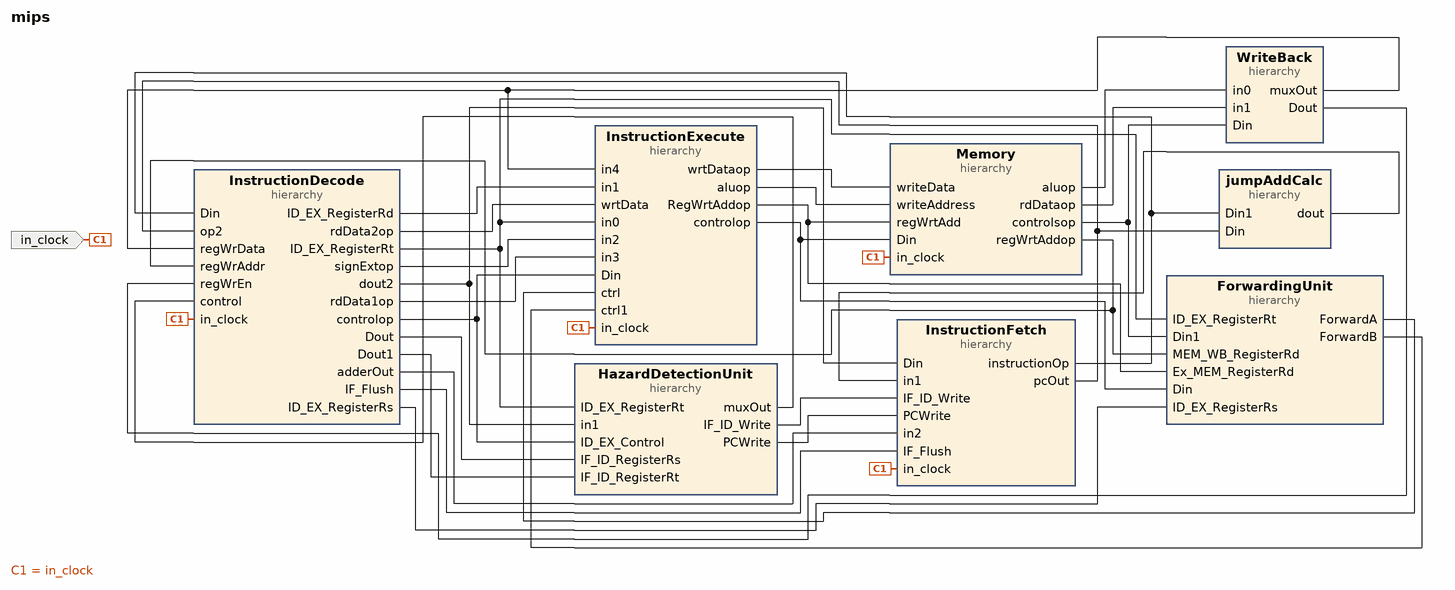
[diagram p0: block diagram of the top level]
# Vivado block design mips, xc7z020clg400-1, Vivado 2020.2
create_bd_design mips

create_bd_port -dir I -type clk in_clock

create_bd_cell -type hier Memory
create_bd_cell -type hier WriteBack
create_bd_cell -type hier InstructionFetch
create_bd_cell -type hier InstructionExecute
create_bd_cell -type hier ForwardingUnit
create_bd_cell -type hier HazardDetectionUnit
create_bd_cell -type hier jumpAddCalc
create_bd_cell -type hier InstructionDecode

# ---- hierarchy /Memory ----
current_bd_instance /Memory
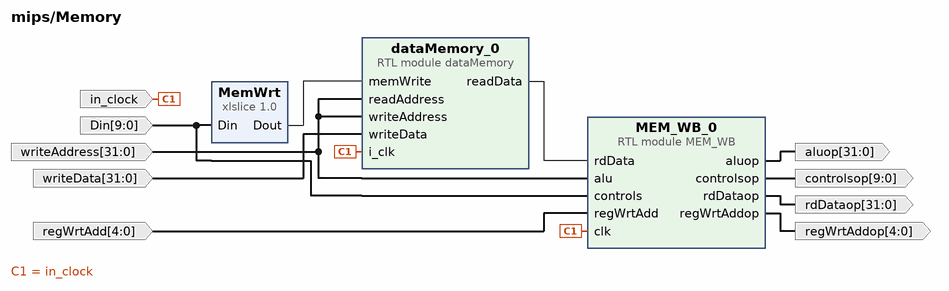
[diagram p1: block diagram inside /Memory]
create_bd_pin -dir I -from 9 -to 0 Din
create_bd_pin -dir I -from 31 -to 0 writeAddress
create_bd_pin -dir I -from 4 -to 0 regWrtAdd
create_bd_pin -dir I -type clk in_clock
create_bd_pin -dir O -from 31 -to 0 rdDataop
create_bd_pin -dir O -from 9 -to 0 controlsop
create_bd_pin -dir O -from 31 -to 0 aluop
create_bd_pin -dir O -from 4 -to 0 regWrtAddop
create_bd_pin -dir I -from 31 -to 0 writeData

create_bd_cell -type module -reference MEM_WB MEM_WB_0
create_bd_cell -type ip -vlnv xilinx.com:ip:xlslice:1.0 MemWrt
set_property -dict {CONFIG.DIN_FROM 6 CONFIG.DIN_TO 6 CONFIG.DIN_WIDTH 10 CONFIG.DOUT_WIDTH 1} [get_bd_cells MemWrt]
create_bd_cell -type module -reference dataMemory dataMemory_0

# ---- hierarchy /WriteBack ----
current_bd_instance /WriteBack
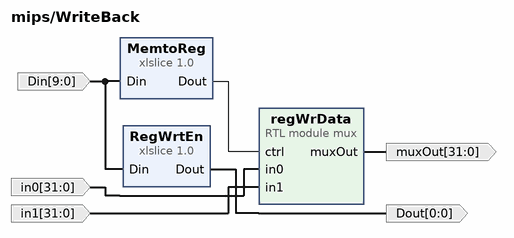
[diagram p2: block diagram inside /WriteBack]
create_bd_pin -dir I -from 31 -to 0 in0
create_bd_pin -dir I -from 31 -to 0 in1
create_bd_pin -dir O -from 31 -to 0 muxOut
create_bd_pin -dir I -from 9 -to 0 Din
create_bd_pin -dir O -from 0 -to 0 Dout

create_bd_cell -type ip -vlnv xilinx.com:ip:xlslice:1.0 MemtoReg
set_property -dict {CONFIG.DIN_FROM 7 CONFIG.DIN_TO 7 CONFIG.DIN_WIDTH 10 CONFIG.DOUT_WIDTH 1} [get_bd_cells MemtoReg]
create_bd_cell -type ip -vlnv xilinx.com:ip:xlslice:1.0 RegWrtEn
set_property -dict {CONFIG.DIN_FROM 1 CONFIG.DIN_TO 1 CONFIG.DIN_WIDTH 10 CONFIG.DOUT_WIDTH 1} [get_bd_cells RegWrtEn]
create_bd_cell -type module -reference mux regWrData
set_property -dict {CONFIG.width 32} [get_bd_cells regWrData]

# ---- hierarchy /InstructionFetch ----
current_bd_instance /InstructionFetch
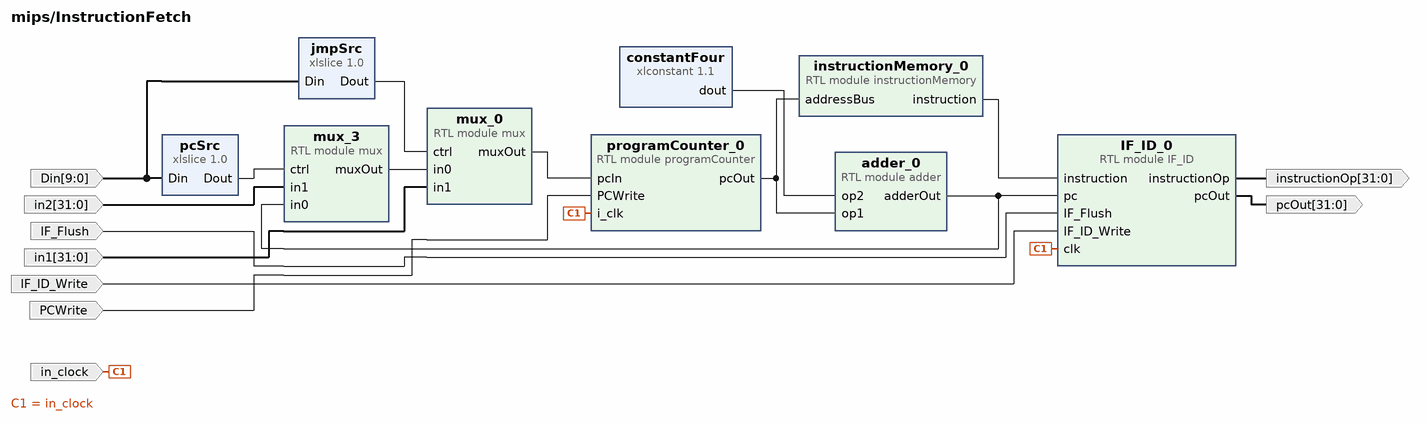
[diagram p3: block diagram inside /InstructionFetch]
create_bd_pin -dir I -from 9 -to 0 Din
create_bd_pin -dir I -type clk in_clock
create_bd_pin -dir I IF_Flush
create_bd_pin -dir O -from 31 -to 0 instructionOp
create_bd_pin -dir O -from 31 -to 0 pcOut
create_bd_pin -dir I -from 31 -to 0 in1
create_bd_pin -dir I -from 31 -to 0 in2
create_bd_pin -dir I IF_ID_Write
create_bd_pin -dir I PCWrite

create_bd_cell -type ip -vlnv xilinx.com:ip:xlslice:1.0 jmpSrc
set_property -dict {CONFIG.DIN_FROM 8 CONFIG.DIN_TO 8 CONFIG.DIN_WIDTH 10 CONFIG.DOUT_WIDTH 1} [get_bd_cells jmpSrc]
create_bd_cell -type module -reference mux mux_0
set_property -dict {CONFIG.width 32} [get_bd_cells mux_0]
create_bd_cell -type ip -vlnv xilinx.com:ip:xlslice:1.0 pcSrc
set_property -dict {CONFIG.DIN_FROM 9 CONFIG.DIN_TO 9 CONFIG.DIN_WIDTH 10 CONFIG.DOUT_WIDTH 1} [get_bd_cells pcSrc]
create_bd_cell -type ip -vlnv xilinx.com:ip:xlconstant:1.1 constantFour
set_property -dict {CONFIG.CONST_VAL 4 CONFIG.CONST_WIDTH 32} [get_bd_cells constantFour]
create_bd_cell -type module -reference adder adder_0
set_property -dict {CONFIG.width 32} [get_bd_cells adder_0]
create_bd_cell -type module -reference mux mux_3
set_property -dict {CONFIG.width 32} [get_bd_cells mux_3]
create_bd_cell -type module -reference programCounter programCounter_0
create_bd_cell -type module -reference IF_ID IF_ID_0
create_bd_cell -type module -reference instructionMemory instructionMemory_0

# ---- hierarchy /InstructionExecute ----
current_bd_instance /InstructionExecute
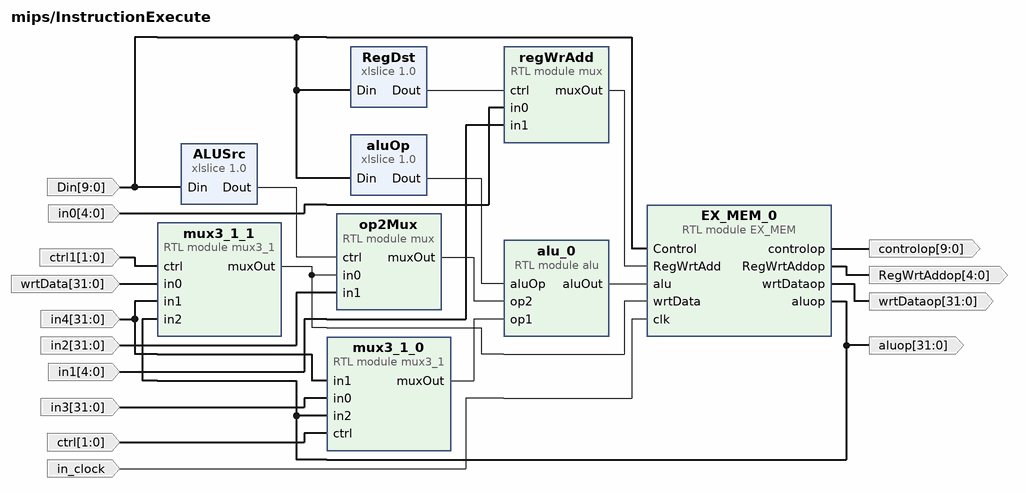
[diagram p4: block diagram inside /InstructionExecute]
create_bd_pin -dir I -from 4 -to 0 in0
create_bd_pin -dir I -from 4 -to 0 in1
create_bd_pin -dir I -from 9 -to 0 Din
create_bd_pin -dir I -from 31 -to 0 wrtData
create_bd_pin -dir I -from 31 -to 0 in2
create_bd_pin -dir I -from 31 -to 0 in3
create_bd_pin -dir I -from 31 -to 0 in4
create_bd_pin -dir O -from 31 -to 0 aluop
create_bd_pin -dir I -from 1 -to 0 ctrl
create_bd_pin -dir I -type clk in_clock
create_bd_pin -dir O -from 9 -to 0 controlop
create_bd_pin -dir O -from 31 -to 0 wrtDataop
create_bd_pin -dir O -from 4 -to 0 RegWrtAddop
create_bd_pin -dir I -from 1 -to 0 ctrl1

create_bd_cell -type module -reference alu alu_0
create_bd_cell -type module -reference mux regWrAdd
set_property -dict {CONFIG.width 5} [get_bd_cells regWrAdd]
create_bd_cell -type ip -vlnv xilinx.com:ip:xlslice:1.0 RegDst
set_property -dict {CONFIG.DIN_WIDTH 10} [get_bd_cells RegDst]
create_bd_cell -type module -reference mux op2Mux
set_property -dict {CONFIG.width 32} [get_bd_cells op2Mux]
create_bd_cell -type module -reference mux3_1 mux3_1_0
set_property -dict {CONFIG.width 32} [get_bd_cells mux3_1_0]
create_bd_cell -type module -reference EX_MEM EX_MEM_0
create_bd_cell -type ip -vlnv xilinx.com:ip:xlslice:1.0 aluOp
set_property -dict {CONFIG.DIN_FROM 5 CONFIG.DIN_TO 3 CONFIG.DIN_WIDTH 10 CONFIG.DOUT_WIDTH 3} [get_bd_cells aluOp]
create_bd_cell -type ip -vlnv xilinx.com:ip:xlslice:1.0 ALUSrc
set_property -dict {CONFIG.DIN_FROM 2 CONFIG.DIN_TO 2 CONFIG.DIN_WIDTH 10 CONFIG.DOUT_WIDTH 1} [get_bd_cells ALUSrc]
create_bd_cell -type module -reference mux3_1 mux3_1_1
set_property -dict {CONFIG.width 32} [get_bd_cells mux3_1_1]

# ---- hierarchy /ForwardingUnit ----
current_bd_instance /ForwardingUnit
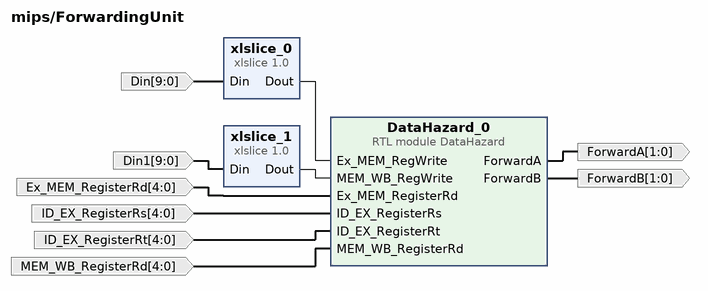
[diagram p5: block diagram inside /ForwardingUnit]
create_bd_pin -dir I -from 9 -to 0 Din
create_bd_pin -dir I -from 9 -to 0 Din1
create_bd_pin -dir I -from 4 -to 0 Ex_MEM_RegisterRd
create_bd_pin -dir I -from 4 -to 0 ID_EX_RegisterRs
create_bd_pin -dir I -from 4 -to 0 ID_EX_RegisterRt
create_bd_pin -dir I -from 4 -to 0 MEM_WB_RegisterRd
create_bd_pin -dir O -from 1 -to 0 ForwardA
create_bd_pin -dir O -from 1 -to 0 ForwardB

create_bd_cell -type ip -vlnv xilinx.com:ip:xlslice:1.0 xlslice_0
set_property -dict {CONFIG.DIN_FROM 1 CONFIG.DIN_TO 1 CONFIG.DIN_WIDTH 10 CONFIG.DOUT_WIDTH 1} [get_bd_cells xlslice_0]
create_bd_cell -type ip -vlnv xilinx.com:ip:xlslice:1.0 xlslice_1
set_property -dict {CONFIG.DIN_FROM 1 CONFIG.DIN_TO 1 CONFIG.DIN_WIDTH 10 CONFIG.DOUT_WIDTH 1} [get_bd_cells xlslice_1]
create_bd_cell -type module -reference DataHazard DataHazard_0

# ---- hierarchy /HazardDetectionUnit ----
current_bd_instance /HazardDetectionUnit
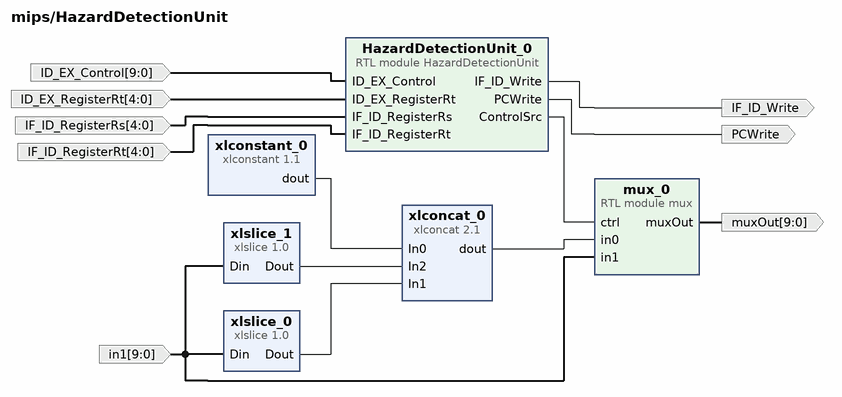
[diagram p6: block diagram inside /HazardDetectionUnit]
create_bd_pin -dir I -from 9 -to 0 ID_EX_Control
create_bd_pin -dir I -from 4 -to 0 ID_EX_RegisterRt
create_bd_pin -dir I -from 4 -to 0 IF_ID_RegisterRs
create_bd_pin -dir I -from 4 -to 0 IF_ID_RegisterRt
create_bd_pin -dir O PCWrite
create_bd_pin -dir O IF_ID_Write
create_bd_pin -dir I -from 9 -to 0 in1
create_bd_pin -dir O -from 9 -to 0 muxOut

create_bd_cell -type ip -vlnv xilinx.com:ip:xlconstant:1.1 xlconstant_0
set_property -dict {CONFIG.CONST_VAL 0 CONFIG.CONST_WIDTH 8} [get_bd_cells xlconstant_0]
create_bd_cell -type module -reference mux mux_0
set_property -dict {CONFIG.width 10} [get_bd_cells mux_0]
create_bd_cell -type module -reference HazardDetectionUnit HazardDetectionUnit_0
create_bd_cell -type ip -vlnv xilinx.com:ip:xlslice:1.0 xlslice_0
set_property -dict {CONFIG.DIN_FROM 8 CONFIG.DIN_TO 8 CONFIG.DIN_WIDTH 10 CONFIG.DOUT_WIDTH 1} [get_bd_cells xlslice_0]
create_bd_cell -type ip -vlnv xilinx.com:ip:xlslice:1.0 xlslice_1
set_property -dict {CONFIG.DIN_FROM 9 CONFIG.DIN_TO 9 CONFIG.DIN_WIDTH 10 CONFIG.DOUT_WIDTH 1} [get_bd_cells xlslice_1]
create_bd_cell -type ip -vlnv xilinx.com:ip:xlconcat:2.1 xlconcat_0
set_property -dict {CONFIG.IN0_WIDTH 8 CONFIG.NUM_PORTS 3} [get_bd_cells xlconcat_0]

# ---- hierarchy /jumpAddCalc ----
current_bd_instance /jumpAddCalc
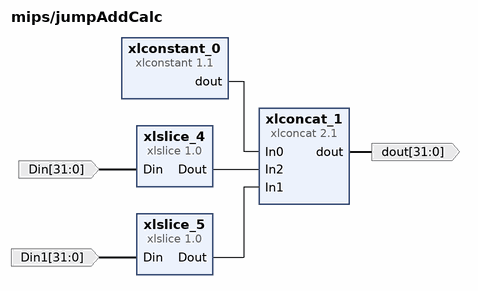
[diagram p7: block diagram inside /jumpAddCalc]
create_bd_pin -dir I -from 31 -to 0 Din
create_bd_pin -dir I -from 31 -to 0 Din1
create_bd_pin -dir O -from 31 -to 0 dout

create_bd_cell -type ip -vlnv xilinx.com:ip:xlconcat:2.1 xlconcat_1
set_property -dict {CONFIG.IN0_WIDTH 2 CONFIG.IN1_WIDTH 26 CONFIG.IN2_WIDTH 4 CONFIG.NUM_PORTS 3} [get_bd_cells xlconcat_1]
create_bd_cell -type ip -vlnv xilinx.com:ip:xlslice:1.0 xlslice_4
set_property -dict {CONFIG.DIN_FROM 31 CONFIG.DIN_TO 28 CONFIG.DOUT_WIDTH 4} [get_bd_cells xlslice_4]
create_bd_cell -type ip -vlnv xilinx.com:ip:xlslice:1.0 xlslice_5
set_property -dict {CONFIG.DIN_FROM 25 CONFIG.DOUT_WIDTH 26} [get_bd_cells xlslice_5]
create_bd_cell -type ip -vlnv xilinx.com:ip:xlconstant:1.1 xlconstant_0
set_property -dict {CONFIG.CONST_VAL 0 CONFIG.CONST_WIDTH 2} [get_bd_cells xlconstant_0]

# ---- hierarchy /InstructionDecode ----
current_bd_instance /InstructionDecode
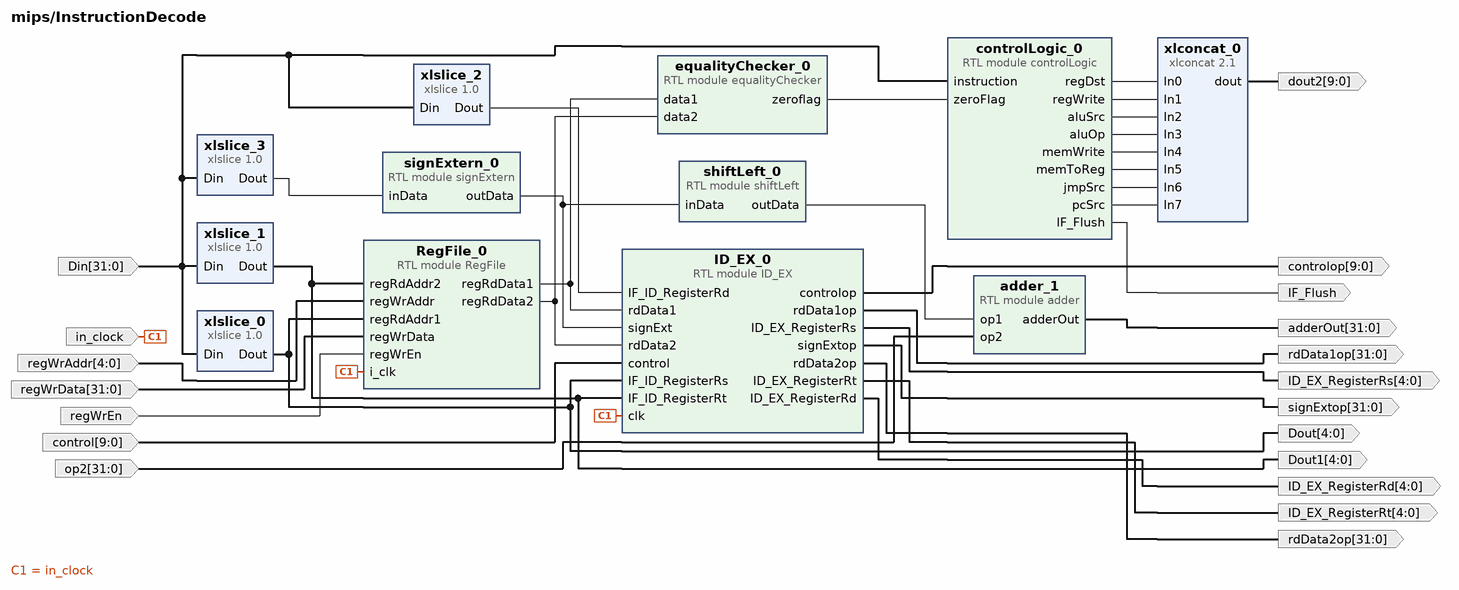
[diagram p8: block diagram inside /InstructionDecode]
create_bd_pin -dir I -type clk in_clock
create_bd_pin -dir I -from 9 -to 0 control
create_bd_pin -dir O -from 4 -to 0 Dout
create_bd_pin -dir O -from 4 -to 0 Dout1
create_bd_pin -dir O -from 9 -to 0 controlop
create_bd_pin -dir O -from 31 -to 0 signExtop
create_bd_pin -dir O -from 31 -to 0 rdData1op
create_bd_pin -dir O -from 31 -to 0 rdData2op
create_bd_pin -dir O -from 4 -to 0 ID_EX_RegisterRs
create_bd_pin -dir O -from 4 -to 0 ID_EX_RegisterRt
create_bd_pin -dir O -from 4 -to 0 ID_EX_RegisterRd
create_bd_pin -dir I -from 31 -to 0 Din
create_bd_pin -dir O IF_Flush
create_bd_pin -dir I -from 4 -to 0 regWrAddr
create_bd_pin -dir I -from 31 -to 0 regWrData
create_bd_pin -dir I regWrEn
create_bd_pin -dir I -from 31 -to 0 op2
create_bd_pin -dir O -from 31 -to 0 adderOut
create_bd_pin -dir O -from 9 -to 0 dout2

create_bd_cell -type module -reference ID_EX ID_EX_0
create_bd_cell -type module -reference controlLogic controlLogic_0
create_bd_cell -type ip -vlnv xilinx.com:ip:xlslice:1.0 xlslice_0
set_property -dict {CONFIG.DIN_FROM 25 CONFIG.DIN_TO 21 CONFIG.DOUT_WIDTH 5} [get_bd_cells xlslice_0]
create_bd_cell -type ip -vlnv xilinx.com:ip:xlslice:1.0 xlslice_1
set_property -dict {CONFIG.DIN_FROM 20 CONFIG.DIN_TO 16 CONFIG.DOUT_WIDTH 5} [get_bd_cells xlslice_1]
create_bd_cell -type module -reference shiftLeft shiftLeft_0
create_bd_cell -type ip -vlnv xilinx.com:ip:xlslice:1.0 xlslice_2
set_property -dict {CONFIG.DIN_FROM 15 CONFIG.DIN_TO 11 CONFIG.DOUT_WIDTH 5} [get_bd_cells xlslice_2]
create_bd_cell -type ip -vlnv xilinx.com:ip:xlslice:1.0 xlslice_3
set_property -dict {CONFIG.DIN_FROM 15 CONFIG.DOUT_WIDTH 16} [get_bd_cells xlslice_3]
create_bd_cell -type module -reference equalityChecker equalityChecker_0
create_bd_cell -type module -reference RegFile RegFile_0
create_bd_cell -type module -reference signExtern signExtern_0
create_bd_cell -type module -reference adder adder_1
set_property -dict {CONFIG.width 32} [get_bd_cells adder_1]
create_bd_cell -type ip -vlnv xilinx.com:ip:xlconcat:2.1 xlconcat_0
set_property -dict {CONFIG.IN3_WIDTH 3 CONFIG.NUM_PORTS 8} [get_bd_cells xlconcat_0]

# ---- connections ----

current_bd_instance /Memory
connect_bd_net [get_bd_pins dataMemory_0/readData] [get_bd_pins MEM_WB_0/rdData]
connect_bd_net -net xlslice_0_Dout [get_bd_pins MemWrt/Dout] [get_bd_pins dataMemory_0/memWrite]
connect_bd_net -net EX_MEM_0_controlop [get_bd_pins Din] [get_bd_pins MemWrt/Din] [get_bd_pins MEM_WB_0/controls]
connect_bd_net -net InstructionExecute_aluop [get_bd_pins writeAddress] \
  [get_bd_pins MEM_WB_0/alu] [get_bd_pins dataMemory_0/readAddress] [get_bd_pins dataMemory_0/writeAddress]
connect_bd_net -net InstructionExecute_RegWrtAddop [get_bd_pins regWrtAdd] [get_bd_pins MEM_WB_0/regWrtAdd]
connect_bd_net -net i_clk_0_1 [get_bd_pins in_clock] [get_bd_pins MEM_WB_0/clk] [get_bd_pins dataMemory_0/i_clk]
connect_bd_net [get_bd_pins MEM_WB_0/rdDataop] [get_bd_pins rdDataop]
connect_bd_net [get_bd_pins MEM_WB_0/controlsop] [get_bd_pins controlsop]
connect_bd_net [get_bd_pins MEM_WB_0/aluop] [get_bd_pins aluop]
connect_bd_net -net regWrAddr_1 [get_bd_pins MEM_WB_0/regWrtAddop] [get_bd_pins regWrtAddop]
connect_bd_net -net EX_MEM_0_wrtDataop [get_bd_pins writeData] [get_bd_pins dataMemory_0/writeData]

current_bd_instance /WriteBack
connect_bd_net -net xlslice_0_Dout1 [get_bd_pins MemtoReg/Dout] [get_bd_pins regWrData/ctrl]
connect_bd_net -net MEM_WB_0_aluop [get_bd_pins in0] [get_bd_pins regWrData/in0]
connect_bd_net -net MEM_WB_0_rdDataop [get_bd_pins in1] [get_bd_pins regWrData/in1]
connect_bd_net -net mux_2_muxOut [get_bd_pins regWrData/muxOut] [get_bd_pins muxOut]
connect_bd_net -net MEM_WB_0_controlsop [get_bd_pins Din] [get_bd_pins RegWrtEn/Din] [get_bd_pins MemtoReg/Din]
connect_bd_net -net xlslice_0_Dout [get_bd_pins RegWrtEn/Dout] [get_bd_pins Dout]

current_bd_instance /InstructionFetch
connect_bd_net -net xlslice_0_Dout1 [get_bd_pins jmpSrc/Dout] [get_bd_pins mux_0/ctrl]
connect_bd_net [get_bd_pins instructionMemory_0/instruction] [get_bd_pins IF_ID_0/instruction]
connect_bd_net [get_bd_pins adder_0/adderOut] [get_bd_pins mux_3/in0] [get_bd_pins IF_ID_0/pc]
connect_bd_net [get_bd_pins mux_3/muxOut] [get_bd_pins mux_0/in0]
connect_bd_net [get_bd_pins mux_0/muxOut] [get_bd_pins programCounter_0/pcIn]
connect_bd_net [get_bd_pins programCounter_0/pcOut] [get_bd_pins adder_0/op1] [get_bd_pins instructionMemory_0/addressBus]
connect_bd_net [get_bd_pins pcSrc/Dout] [get_bd_pins mux_3/ctrl]
connect_bd_net [get_bd_pins constantFour/dout] [get_bd_pins adder_0/op2]
connect_bd_net -net Conrols [get_bd_pins Din] [get_bd_pins pcSrc/Din] [get_bd_pins jmpSrc/Din]
connect_bd_net -net i_clk_0_1 [get_bd_pins in_clock] [get_bd_pins programCounter_0/i_clk] [get_bd_pins IF_ID_0/clk]
connect_bd_net -net InsructionDecode_IF_Flush [get_bd_pins IF_Flush] [get_bd_pins IF_ID_0/IF_Flush]
connect_bd_net [get_bd_pins IF_ID_0/instructionOp] [get_bd_pins instructionOp]
connect_bd_net -net InstructionFetch_pcOut [get_bd_pins IF_ID_0/pcOut] [get_bd_pins pcOut]
connect_bd_net -net InsructionDecode_dout1 [get_bd_pins in1] [get_bd_pins mux_0/in1]
connect_bd_net -net InstructionDecode_adderOut [get_bd_pins in2] [get_bd_pins mux_3/in1]
connect_bd_net [get_bd_pins IF_ID_Write] [get_bd_pins IF_ID_0/IF_ID_Write]
connect_bd_net [get_bd_pins PCWrite] [get_bd_pins programCounter_0/PCWrite]

current_bd_instance /InstructionExecute
connect_bd_net [get_bd_pins mux3_1_0/muxOut] [get_bd_pins alu_0/op1]
connect_bd_net -net xlslice_0_Dout1 [get_bd_pins aluOp/Dout] [get_bd_pins alu_0/aluOp]
connect_bd_net [get_bd_pins alu_0/aluOut] [get_bd_pins EX_MEM_0/alu]
connect_bd_net -net xlslice_0_Dout_1 [get_bd_pins RegDst/Dout] [get_bd_pins regWrAdd/ctrl]
connect_bd_net [get_bd_pins regWrAdd/muxOut] [get_bd_pins EX_MEM_0/RegWrtAdd]
connect_bd_net -net xlslice_4_Dout [get_bd_pins ALUSrc/Dout] [get_bd_pins op2Mux/ctrl]
connect_bd_net -net ID_EX_0_slicetsop [get_bd_pins in0] [get_bd_pins regWrAdd/in0]
connect_bd_net -net ID_EX_0_slicefeop [get_bd_pins in1] [get_bd_pins regWrAdd/in1]
connect_bd_net -net ID_EX_0_controlop [get_bd_pins Din] \
  [get_bd_pins ALUSrc/Din] [get_bd_pins aluOp/Din] [get_bd_pins EX_MEM_0/Control] [get_bd_pins RegDst/Din]
connect_bd_net -net InstructionDecode_signExtop [get_bd_pins in2] [get_bd_pins op2Mux/in1]
connect_bd_net -net InsructionDecode_rdData1op [get_bd_pins in3] [get_bd_pins mux3_1_0/in0]
connect_bd_net -net mux_2_muxOut [get_bd_pins in4] [get_bd_pins mux3_1_1/in1] [get_bd_pins mux3_1_0/in1]
connect_bd_net -net InstructionExecute_aluop [get_bd_pins EX_MEM_0/aluop] [get_bd_pins aluop] [get_bd_pins mux3_1_1/in2] [get_bd_pins mux3_1_0/in2]
connect_bd_net -net ForwardingUnit_ForwardA [get_bd_pins ctrl] [get_bd_pins mux3_1_0/ctrl]
connect_bd_net -net i_clk_0_1 [get_bd_pins in_clock] [get_bd_pins EX_MEM_0/clk]
connect_bd_net -net InstructionExecute_controlop [get_bd_pins EX_MEM_0/controlop] [get_bd_pins controlop]
connect_bd_net [get_bd_pins EX_MEM_0/wrtDataop] [get_bd_pins wrtDataop]
connect_bd_net -net InstructionExecute_RegWrtAddop [get_bd_pins EX_MEM_0/RegWrtAddop] [get_bd_pins RegWrtAddop]
connect_bd_net -net ForwardingUnit_ForwardB [get_bd_pins ctrl1] [get_bd_pins mux3_1_1/ctrl]
connect_bd_net [get_bd_pins wrtData] [get_bd_pins mux3_1_1/in0]
connect_bd_net [get_bd_pins mux3_1_1/muxOut] [get_bd_pins op2Mux/in0] [get_bd_pins EX_MEM_0/wrtData]
connect_bd_net [get_bd_pins op2Mux/muxOut] [get_bd_pins alu_0/op2]

current_bd_instance /ForwardingUnit
connect_bd_net [get_bd_pins xlslice_0/Dout] [get_bd_pins DataHazard_0/Ex_MEM_RegWrite]
connect_bd_net [get_bd_pins xlslice_1/Dout] [get_bd_pins DataHazard_0/MEM_WB_RegWrite]
connect_bd_net -net InstructionExecute_controlop [get_bd_pins Din] [get_bd_pins xlslice_0/Din]
connect_bd_net -net MEM_WB_0_controlsop [get_bd_pins Din1] [get_bd_pins xlslice_1/Din]
connect_bd_net -net InstructionExecute_RegWrtAddop [get_bd_pins Ex_MEM_RegisterRd] [get_bd_pins DataHazard_0/Ex_MEM_RegisterRd]
connect_bd_net -net InsructionDecode_ID_EX_RegisterRs [get_bd_pins ID_EX_RegisterRs] [get_bd_pins DataHazard_0/ID_EX_RegisterRs]
connect_bd_net -net ID_EX_0_slicetsop [get_bd_pins ID_EX_RegisterRt] [get_bd_pins DataHazard_0/ID_EX_RegisterRt]
connect_bd_net -net regWrAddr_1 [get_bd_pins MEM_WB_RegisterRd] [get_bd_pins DataHazard_0/MEM_WB_RegisterRd]
connect_bd_net -net ForwardingUnit_ForwardA [get_bd_pins DataHazard_0/ForwardA] [get_bd_pins ForwardA]
connect_bd_net -net ForwardingUnit_ForwardB [get_bd_pins DataHazard_0/ForwardB] [get_bd_pins ForwardB]

current_bd_instance /HazardDetectionUnit
connect_bd_net [get_bd_pins HazardDetectionUnit_0/ControlSrc] [get_bd_pins mux_0/ctrl]
connect_bd_net -net ID_EX_0_controlop [get_bd_pins ID_EX_Control] [get_bd_pins HazardDetectionUnit_0/ID_EX_Control]
connect_bd_net -net ID_EX_0_slicetsop [get_bd_pins ID_EX_RegisterRt] [get_bd_pins HazardDetectionUnit_0/ID_EX_RegisterRt]
connect_bd_net -net xlslice_0_Dout_1 [get_bd_pins IF_ID_RegisterRs] [get_bd_pins HazardDetectionUnit_0/IF_ID_RegisterRs]
connect_bd_net -net xlslice_1_Dout [get_bd_pins IF_ID_RegisterRt] [get_bd_pins HazardDetectionUnit_0/IF_ID_RegisterRt]
connect_bd_net [get_bd_pins HazardDetectionUnit_0/PCWrite] [get_bd_pins PCWrite]
connect_bd_net [get_bd_pins HazardDetectionUnit_0/IF_ID_Write] [get_bd_pins IF_ID_Write]
connect_bd_net -net xlconcat_0_dout [get_bd_pins in1] [get_bd_pins mux_0/in1] [get_bd_pins xlslice_0/Din] [get_bd_pins xlslice_1/Din]
connect_bd_net [get_bd_pins mux_0/muxOut] [get_bd_pins muxOut]
connect_bd_net [get_bd_pins xlconstant_0/dout] [get_bd_pins xlconcat_0/In0]
connect_bd_net [get_bd_pins xlslice_0/Dout] [get_bd_pins xlconcat_0/In1]
connect_bd_net [get_bd_pins xlslice_1/Dout] [get_bd_pins xlconcat_0/In2]
connect_bd_net [get_bd_pins xlconcat_0/dout] [get_bd_pins mux_0/in0]

current_bd_instance /jumpAddCalc
connect_bd_net [get_bd_pins xlslice_5/Dout] [get_bd_pins xlconcat_1/In1]
connect_bd_net -net InstructionFetch_pcOut [get_bd_pins Din] [get_bd_pins xlslice_4/Din]
connect_bd_net -net IF_ID_0_instructionOp [get_bd_pins Din1] [get_bd_pins xlslice_5/Din]
connect_bd_net [get_bd_pins xlconcat_1/dout] [get_bd_pins dout]
connect_bd_net [get_bd_pins xlconstant_0/dout] [get_bd_pins xlconcat_1/In0]
connect_bd_net [get_bd_pins xlslice_4/Dout] [get_bd_pins xlconcat_1/In2]

current_bd_instance /InstructionDecode
connect_bd_net -net InstructionDecode_outData [get_bd_pins signExtern_0/outData] [get_bd_pins shiftLeft_0/inData] [get_bd_pins ID_EX_0/signExt]
connect_bd_net [get_bd_pins RegFile_0/regRdData1] [get_bd_pins equalityChecker_0/data1] [get_bd_pins ID_EX_0/rdData1]
connect_bd_net [get_bd_pins RegFile_0/regRdData2] [get_bd_pins equalityChecker_0/data2] [get_bd_pins ID_EX_0/rdData2]
connect_bd_net [get_bd_pins xlslice_2/Dout] [get_bd_pins ID_EX_0/IF_ID_RegisterRd]
connect_bd_net -net alu_0_zeroFlag1 [get_bd_pins equalityChecker_0/zeroflag] [get_bd_pins controlLogic_0/zeroFlag]
connect_bd_net [get_bd_pins controlLogic_0/regDst] [get_bd_pins xlconcat_0/In0]
connect_bd_net [get_bd_pins controlLogic_0/regWrite] [get_bd_pins xlconcat_0/In1]
connect_bd_net [get_bd_pins controlLogic_0/aluSrc] [get_bd_pins xlconcat_0/In2]
connect_bd_net [get_bd_pins controlLogic_0/aluOp] [get_bd_pins xlconcat_0/In3]
connect_bd_net [get_bd_pins controlLogic_0/memWrite] [get_bd_pins xlconcat_0/In4]
connect_bd_net [get_bd_pins controlLogic_0/memToReg] [get_bd_pins xlconcat_0/In5]
connect_bd_net [get_bd_pins controlLogic_0/jmpSrc] [get_bd_pins xlconcat_0/In6]
connect_bd_net [get_bd_pins controlLogic_0/pcSrc] [get_bd_pins xlconcat_0/In7]
connect_bd_net [get_bd_pins shiftLeft_0/outData] [get_bd_pins adder_1/op1]
connect_bd_net [get_bd_pins xlslice_3/Dout] [get_bd_pins signExtern_0/inData]
connect_bd_net -net i_clk_0_1 [get_bd_pins in_clock] [get_bd_pins RegFile_0/i_clk] [get_bd_pins ID_EX_0/clk]
connect_bd_net -net mux_0_muxOut [get_bd_pins control] [get_bd_pins ID_EX_0/control]
connect_bd_net [get_bd_pins xlslice_0/Dout] [get_bd_pins Dout] [get_bd_pins RegFile_0/regRdAddr1] [get_bd_pins ID_EX_0/IF_ID_RegisterRs]
connect_bd_net [get_bd_pins xlslice_1/Dout] [get_bd_pins Dout1] [get_bd_pins RegFile_0/regRdAddr2] [get_bd_pins ID_EX_0/IF_ID_RegisterRt]
connect_bd_net [get_bd_pins ID_EX_0/controlop] [get_bd_pins controlop]
connect_bd_net -net InstructionDecode_signExtop [get_bd_pins ID_EX_0/signExtop] [get_bd_pins signExtop]
connect_bd_net -net InsructionDecode_rdData1op [get_bd_pins ID_EX_0/rdData1op] [get_bd_pins rdData1op]
connect_bd_net -net InstructionDecode_rdData2op [get_bd_pins ID_EX_0/rdData2op] [get_bd_pins rdData2op]
connect_bd_net -net InsructionDecode_ID_EX_RegisterRs [get_bd_pins ID_EX_0/ID_EX_RegisterRs] [get_bd_pins ID_EX_RegisterRs]
connect_bd_net -net ID_EX_0_slicetsop [get_bd_pins ID_EX_0/ID_EX_RegisterRt] [get_bd_pins ID_EX_RegisterRt]
connect_bd_net -net ID_EX_0_slicefeop [get_bd_pins ID_EX_0/ID_EX_RegisterRd] [get_bd_pins ID_EX_RegisterRd]
connect_bd_net -net IF_ID_0_instructionOp [get_bd_pins Din] \
  [get_bd_pins xlslice_3/Din] [get_bd_pins xlslice_2/Din] [get_bd_pins xlslice_1/Din] [get_bd_pins xlslice_0/Din] \
  [get_bd_pins controlLogic_0/instruction]
connect_bd_net -net InsructionDecode_IF_Flush [get_bd_pins controlLogic_0/IF_Flush] [get_bd_pins IF_Flush]
connect_bd_net [get_bd_pins regWrAddr] [get_bd_pins RegFile_0/regWrAddr]
connect_bd_net -net mux_2_muxOut [get_bd_pins regWrData] [get_bd_pins RegFile_0/regWrData]
connect_bd_net -net xlslice_0_Dout [get_bd_pins regWrEn] [get_bd_pins RegFile_0/regWrEn]
connect_bd_net -net InstructionFetch_pcOut [get_bd_pins op2] [get_bd_pins adder_1/op2]
connect_bd_net -net InstructionDecode_adderOut [get_bd_pins adder_1/adderOut] [get_bd_pins adderOut]
connect_bd_net [get_bd_pins xlconcat_0/dout] [get_bd_pins dout2]

current_bd_instance /
connect_bd_net -net i_clk_0_1 [get_bd_ports in_clock] \
  [get_bd_pins Memory/in_clock] [get_bd_pins InstructionFetch/in_clock] [get_bd_pins InstructionExecute/in_clock] \
  [get_bd_pins InstructionDecode/in_clock]
connect_bd_net -net mux_2_muxOut [get_bd_pins WriteBack/muxOut] [get_bd_pins InstructionExecute/in4] [get_bd_pins InstructionDecode/regWrData]
connect_bd_net -net IF_ID_0_instructionOp [get_bd_pins InstructionFetch/instructionOp] \
  [get_bd_pins jumpAddCalc/Din1] [get_bd_pins InstructionDecode/Din]
connect_bd_net -net ID_EX_0_slicetsop [get_bd_pins InstructionDecode/ID_EX_RegisterRt] \
  [get_bd_pins InstructionExecute/in0] [get_bd_pins ForwardingUnit/ID_EX_RegisterRt] \
  [get_bd_pins HazardDetectionUnit/ID_EX_RegisterRt]
connect_bd_net -net ID_EX_0_slicefeop [get_bd_pins InstructionDecode/ID_EX_RegisterRd] [get_bd_pins InstructionExecute/in1]
connect_bd_net [get_bd_pins InstructionFetch/pcOut] [get_bd_pins jumpAddCalc/Din] [get_bd_pins InstructionDecode/op2]
connect_bd_net -net ID_EX_0_controlop [get_bd_pins InstructionDecode/controlop] \
  [get_bd_pins InstructionExecute/Din] [get_bd_pins HazardDetectionUnit/ID_EX_Control]
connect_bd_net [get_bd_pins InstructionDecode/rdData2op] [get_bd_pins InstructionExecute/wrtData]
connect_bd_net -net EX_MEM_0_wrtDataop [get_bd_pins InstructionExecute/wrtDataop] [get_bd_pins Memory/writeData]
connect_bd_net [get_bd_pins InstructionExecute/aluop] [get_bd_pins Memory/writeAddress]
connect_bd_net -net MEM_WB_0_aluop [get_bd_pins Memory/aluop] [get_bd_pins WriteBack/in0]
connect_bd_net -net MEM_WB_0_rdDataop [get_bd_pins Memory/rdDataop] [get_bd_pins WriteBack/in1]
connect_bd_net -net MEM_WB_0_controlsop [get_bd_pins Memory/controlsop] [get_bd_pins WriteBack/Din] [get_bd_pins ForwardingUnit/Din1]
connect_bd_net [get_bd_pins InstructionExecute/RegWrtAddop] [get_bd_pins Memory/regWrtAdd] [get_bd_pins ForwardingUnit/Ex_MEM_RegisterRd]
connect_bd_net -net regWrAddr_1 [get_bd_pins Memory/regWrtAddop] \
  [get_bd_pins ForwardingUnit/MEM_WB_RegisterRd] [get_bd_pins InstructionDecode/regWrAddr]
connect_bd_net -net xlslice_0_Dout [get_bd_pins WriteBack/Dout] [get_bd_pins InstructionDecode/regWrEn]
connect_bd_net [get_bd_pins InstructionDecode/signExtop] [get_bd_pins InstructionExecute/in2]
connect_bd_net [get_bd_pins InstructionDecode/adderOut] [get_bd_pins InstructionFetch/in2]
connect_bd_net [get_bd_pins InstructionExecute/controlop] [get_bd_pins Memory/Din] [get_bd_pins ForwardingUnit/Din]
connect_bd_net -net InsructionDecode_dout1 [get_bd_pins jumpAddCalc/dout] [get_bd_pins InstructionFetch/in1]
connect_bd_net -net InsructionDecode_IF_Flush [get_bd_pins InstructionDecode/IF_Flush] [get_bd_pins InstructionFetch/IF_Flush]
connect_bd_net -net InsructionDecode_ID_EX_RegisterRs [get_bd_pins InstructionDecode/ID_EX_RegisterRs] [get_bd_pins ForwardingUnit/ID_EX_RegisterRs]
connect_bd_net [get_bd_pins ForwardingUnit/ForwardA] [get_bd_pins InstructionExecute/ctrl]
connect_bd_net [get_bd_pins ForwardingUnit/ForwardB] [get_bd_pins InstructionExecute/ctrl1]
connect_bd_net -net InsructionDecode_rdData1op [get_bd_pins InstructionDecode/rdData1op] [get_bd_pins InstructionExecute/in3]
connect_bd_net -net xlconcat_0_dout [get_bd_pins InstructionDecode/dout2] [get_bd_pins InstructionFetch/Din] [get_bd_pins HazardDetectionUnit/in1]
connect_bd_net -net HazardDetectionUnit_0_IF_ID_Write [get_bd_pins HazardDetectionUnit/IF_ID_Write] [get_bd_pins InstructionFetch/IF_ID_Write]
connect_bd_net -net HazardDetectionUnit_0_PCWrite [get_bd_pins HazardDetectionUnit/PCWrite] [get_bd_pins InstructionFetch/PCWrite]
connect_bd_net -net mux_0_muxOut [get_bd_pins HazardDetectionUnit/muxOut] [get_bd_pins InstructionDecode/control]
connect_bd_net -net xlslice_0_Dout_1 [get_bd_pins InstructionDecode/Dout] [get_bd_pins HazardDetectionUnit/IF_ID_RegisterRs]
connect_bd_net -net xlslice_1_Dout [get_bd_pins InstructionDecode/Dout1] [get_bd_pins HazardDetectionUnit/IF_ID_RegisterRt]

validate_bd_design
save_bd_design
